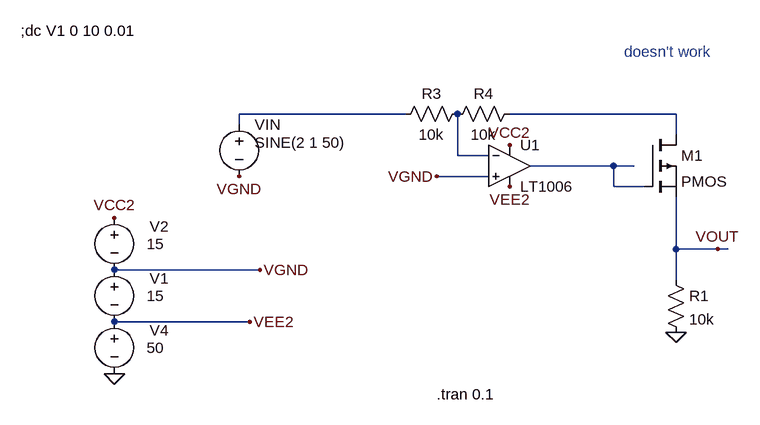
[diagram p0: schematic Draft12.asc]
Draft12.asc, the LTspice schematic file:
Version 4
SHEET 1 1536 680
WIRE 256 16 0 16
WIRE 672 16 416 16
WIRE 0 32 0 16
WIRE 672 48 672 16
WIRE 336 80 336 16
WIRE 384 80 336 80
WIRE 576 96 448 96
WIRE 608 96 576 96
WIRE 384 112 304 112
WIRE 576 128 576 96
WIRE 624 128 576 128
WIRE 672 224 672 144
WIRE 736 224 672 224
WIRE 752 224 736 224
WIRE 32 256 -192 256
WIRE 672 272 672 224
WIRE 16 336 -192 336
FLAG -192 416 0
FLAG 16 336 VEE2
FLAG -192 176 VCC2
FLAG 672 352 0
FLAG 416 128 VEE2
FLAG 416 64 VCC2
FLAG 736 224 VOUT
FLAG 304 112 VGND
FLAG 32 256 VGND
FLAG 0 112 VGND
SYMBOL voltage 0 16 R0
WINDOW 123 0 0 Left 0
WINDOW 39 0 0 Left 0
WINDOW 3 24 44 Left 2
SYMATTR Value SINE(2 1 50)
SYMATTR InstName VIN
SYMBOL voltage -192 320 R0
WINDOW 0 54 29 Left 2
WINDOW 3 50 56 Left 2
WINDOW 123 0 0 Left 0
WINDOW 39 0 0 Left 0
SYMATTR InstName V4
SYMATTR Value 50
SYMBOL voltage -192 240 R0
WINDOW 0 54 29 Left 2
WINDOW 3 50 56 Left 2
WINDOW 123 0 0 Left 0
WINDOW 39 0 0 Left 0
SYMATTR InstName V1
SYMATTR Value 15
SYMBOL res 656 256 R0
SYMATTR InstName R1
SYMATTR Value 10k
SYMBOL OpAmps\\LT1006 416 32 R0
SYMATTR InstName U1
SYMBOL res 352 0 R90
WINDOW 0 0 56 VBottom 2
WINDOW 3 32 56 VTop 2
SYMATTR InstName R3
SYMATTR Value 10k
SYMBOL res 432 0 R90
WINDOW 0 0 56 VBottom 2
WINDOW 3 32 56 VTop 2
SYMATTR InstName R4
SYMATTR Value 10k
SYMBOL pmos 624 48 R0
SYMATTR InstName M1
SYMBOL voltage -192 160 R0
WINDOW 0 54 29 Left 2
WINDOW 3 50 56 Left 2
WINDOW 123 0 0 Left 0
WINDOW 39 0 0 Left 0
SYMATTR InstName V2
SYMATTR Value 15
TEXT -336 -112 Left 2 !;dc V1 0 10 0.01
TEXT 304 448 Left 2 !.tran 0.1
TEXT 592 -80 Left 2 ;doesn't work

The netlist it stands for:
* Draft12.asc
VIN N001 VGND SINE(2 1 50)
V4 VEE2 0 50
V1 VGND VEE2 15
R1 VOUT 0 10k
XU1 VGND N003 VCC2 VEE2 N004 LT1006  ; pins In+ In- V+ V- OUT
R3 N003 N001 10k
R4 N002 N003 10k
M1 N002 N004 VOUT VOUT PMOS
V2 VCC2 VGND 15
.model NMOS NMOS
.model PMOS PMOS
.lib standard.mos
;dc V1 0 10 0.01
.tran 0.1
* doesn't work
.lib LTC.lib
.backanno
.end